# Altium schematic sheet BK1096_Project_Information.SchDoc: =project_title
size Tabloid; CompanyName: Luxonis Holding; Organization: Luxonis Holding; Address1: 1925 Harmony Park Drive; Address2: Westminster, CO; Address3: 80234; Address4: United States; SheetNumber: 2; SheetTotal: 6
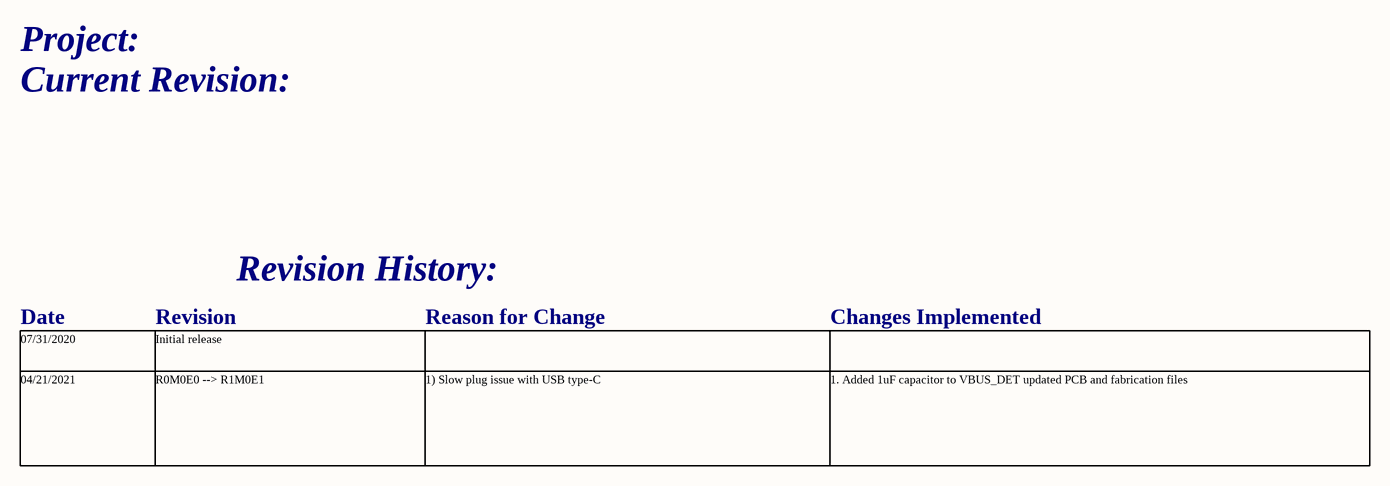
[diagram p0: BK1096_Project_Information.SchDoc]

## Notes on the sheet
- Project:
- Current Revision:
- Revision History:
- 07/31/2020
- Date
- Initial release
- Revision
- Reason for Change
- Changes Implemented
- 04/21/2021
- R0M0E0 --> R1M0E1
- 1) Slow plug issue with USB type-C
- 1. Added 1uF capacitor to VBUS_DET updated PCB and fabrication files
- Title
- Size:
- Date:
- Tabloid
- Number:
- Time:
- Revision:
- Sheet
- of
- Drawn by: